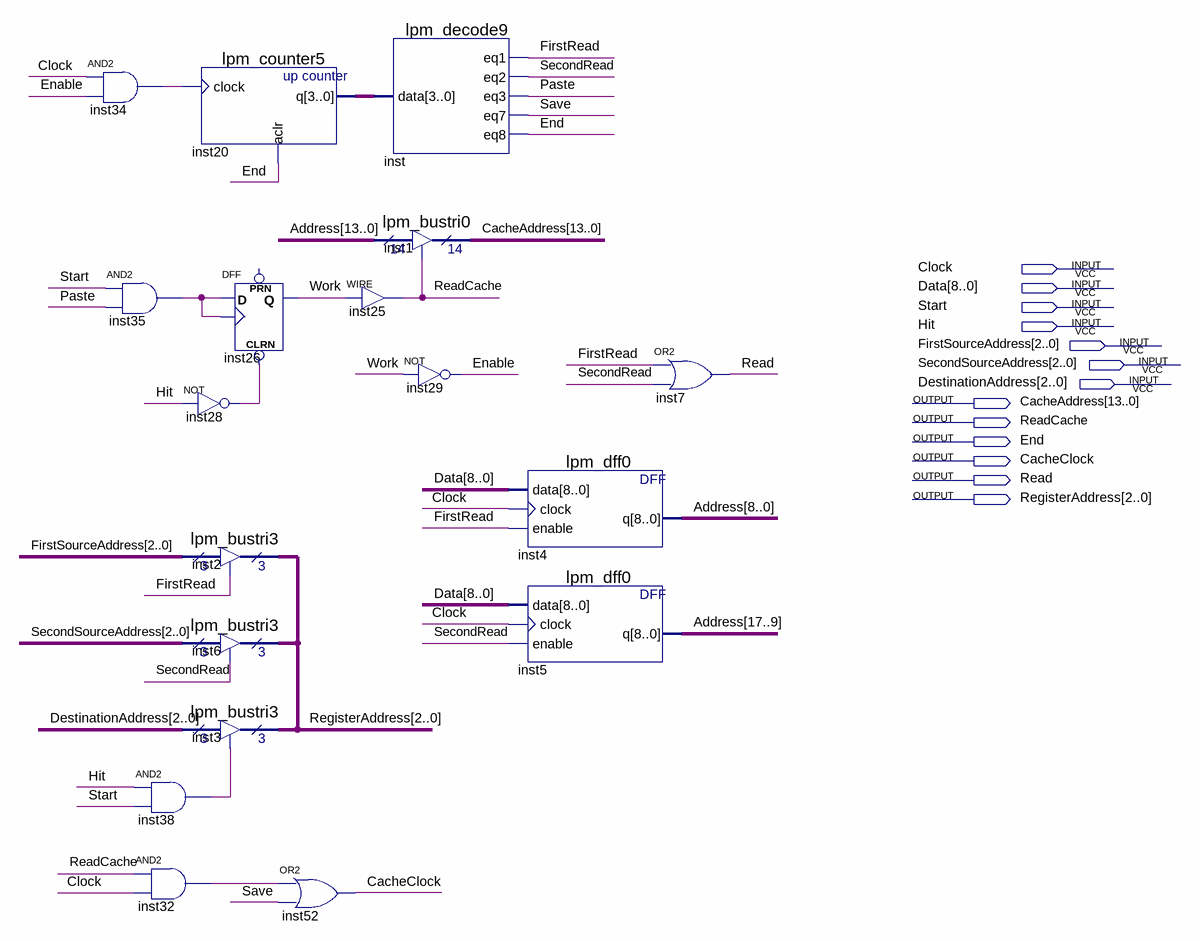
[diagram p0: schematic sheet]
// Quartus schematic MoveRegisterRegister.bdf as structural Verilog: 18 symbols, 13 pins
module MoveRegisterRegister (
  input  Clock,
  input  [8:0] Data,
  input  Start,
  input  Hit,
  input  [2:0] FirstSourceAddress,
  input  [2:0] SecondSourceAddress,
  input  [2:0] DestinationAddress,
  output [13:0] CacheAddress,
  output ReadCache,
  output End,
  output CacheClock,
  output Read,
  output [2:0] RegisterAddress
);

  wire Enable, FirstRead, inst28_out, inst32_out, inst34_out, inst35_out, inst38_out, Paste, Save,
       SecondRead, Work;
  wire [3:0] inst20_q;
  wire [17:0] Address;

  and inst34 (inst34_out, Clock, Enable);
  and inst35 (inst35_out, Start, Paste);
  and inst38 (inst38_out, Hit, Start);
  and inst32 (inst32_out, ReadCache, Clock);
  lpm_counter5 inst20 (.clock(inst34_out), .aclr(End), .q(inst20_q));
  DFF inst26 (.CLRN(inst28_out), .CLK(inst35_out), .D(inst35_out), .Q(Work));  // open: PRN
  not inst28 (inst28_out, Hit);
  lpm_bustri3 inst2 (.enabledt(FirstRead), .data(FirstSourceAddress), .tridata(RegisterAddress));
  lpm_bustri3 inst6 (.enabledt(SecondRead), .data(SecondSourceAddress), .tridata(RegisterAddress));
  lpm_bustri3 inst3 (.enabledt(inst38_out), .data(DestinationAddress), .tridata(RegisterAddress));
  or inst52 (CacheClock, inst32_out, Save);
  lpm_decode9 inst (.data(inst20_q), .eq1(FirstRead), .eq2(SecondRead), .eq3(Paste), .eq7(Save), .eq8(End));
  lpm_bustri0 inst1 (.enabledt(ReadCache), .data(Address[13:0]), .tridata(CacheAddress));
  assign ReadCache = Work;  // WIRE inst25
  not inst29 (Enable, Work);
  lpm_dff0 inst4 (.data(Data), .clock(Clock), .enable(FirstRead), .q(Address[8:0]));
  lpm_dff0 inst5 (.data(Data), .clock(Clock), .enable(SecondRead), .q(Address[17:9]));
  or inst7 (Read, FirstRead, SecondRead);
endmodule
